# EAGLE schematic sc (EAGLE 7.3.0)
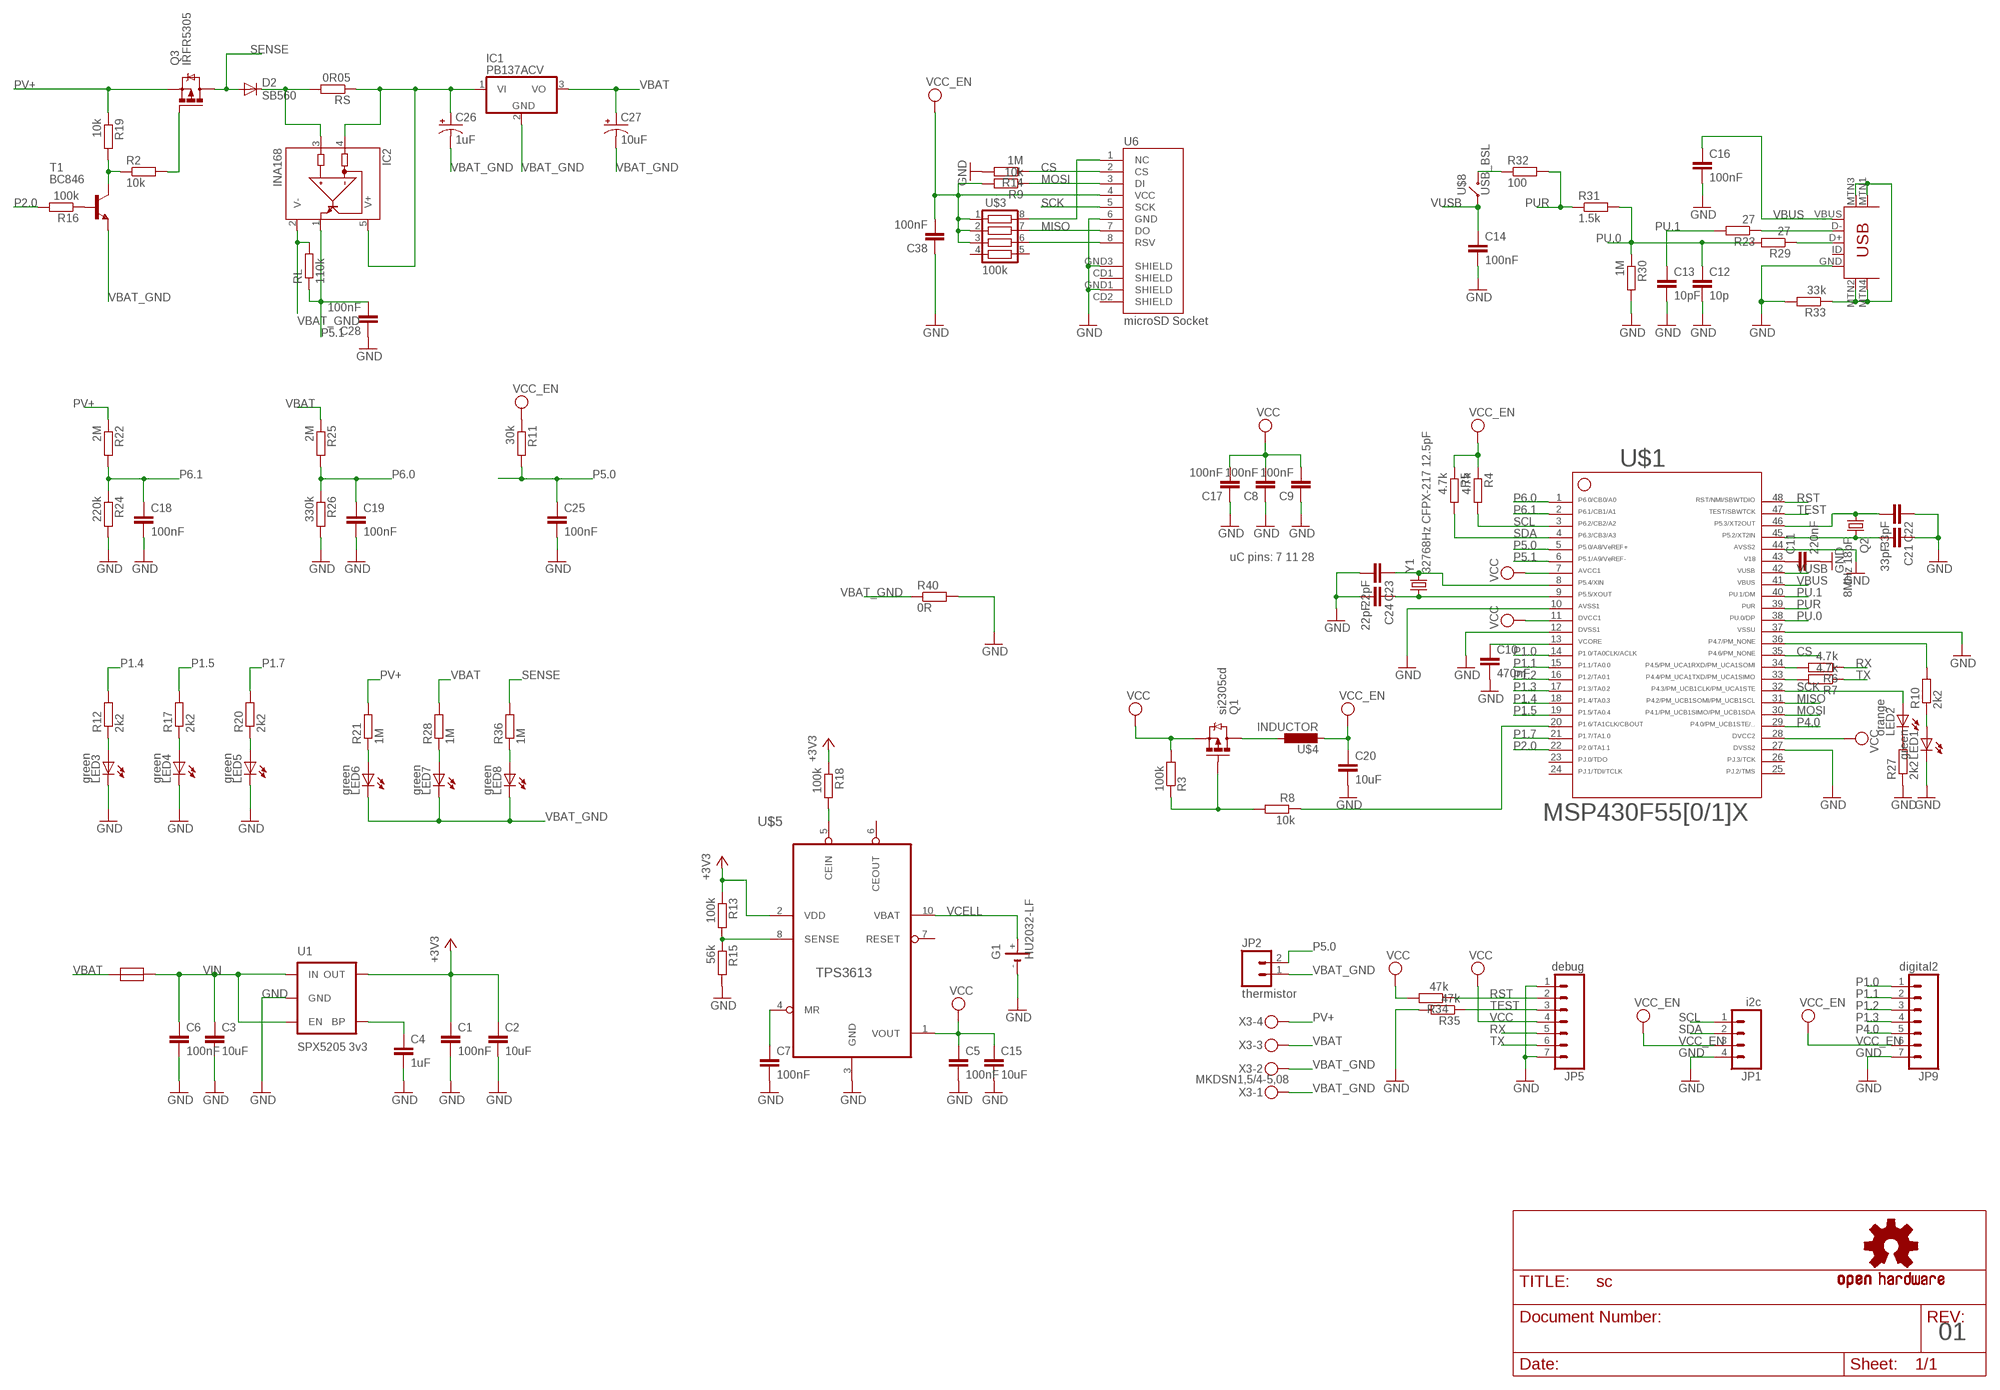
[diagram p0: schematic, sheet 1]

## Parts
C1  100nF  C-EUC0805  [C0805]
C2  10uF  C-EUC1206  [C1206]
C3  10uF  C-EUC1206  [C1206]
C4  1uF  C-EUC0805  [C0805]
C5  100nF  C-EUC0805  [C0805]
C6  100nF  C-EUC0805  [C0805]
C7  100nF  C-EUC0805  [C0805]
C8  100nF  C-EUC0805  [C0805]
C9  100nF  C-EUC0805  [C0805]
C10  470nF  C-EUC0805  [C0805]
C11  220nF  C-EUC0805  [C0805]
C12  10p  C-EUC0805  [C0805]
C13  10pF  C-EUC0805  [C0805]
C14  100nF  C-EUC0805  [C0805]
C15  10uF  C-EUC1206  [C1206]
C16  100nF  C-EUC0805  [C0805]
C17  100nF  C-EUC0805  [C0805]
C18  100nF  C-EUC0805  [C0805]
C19  100nF  C-EUC0805  [C0805]
C20  10uF  C-EUC1206  [C1206]
C21  33pF  C-EUC0805  [C0805]
C22  33pF  C-EUC0805  [C0805]
C23  22pF  C-EUC0805  [C0805]
C24  22pF  C-EUC0805  [C0805]
C25  100nF  C-EUC0805  [C0805]
C26  1uF  CAP_POLD  [PANASONIC_D]
C27  10uF  CAP_POLD  [PANASONIC_D]
C28  100nF  C-EUC0805  [C0805]
C38  100nF  C-EUC0805  [C0805]
D2  SB560  DIODE-C1702-05  [C1702-05]
G1  HU2032-LF  [HU2032-LF]
IC1  PB137ACV  7812TV  [TO220V]
IC2  INA168  [SOT23-5]
JP1  i2c  M04PTH  [1X04]
JP2  thermistor  M02PTH  [1X02]
JP5  debug  M07  [1X07]
JP9  digital2  M07  [1X07]
LED1  green  LEDCHIP-LED0805  [CHIP-LED0805]
LED2  orange  LEDCHIP-LED0805  [CHIP-LED0805]
LED3  green  LEDCHIP-LED0805  [CHIP-LED0805]
LED4  green  LEDCHIP-LED0805  [CHIP-LED0805]
LED5  green  LEDCHIP-LED0805  [CHIP-LED0805]
LED6  green  LEDCHIP-LED0805  [CHIP-LED0805]
LED7  green  LEDCHIP-LED0805  [CHIP-LED0805]
LED8  green  LEDCHIP-LED0805  [CHIP-LED0805]
Q1  si2305cd  MOSFET-PCHANNELSMD_POWER  [SOT23-3_POWER]
Q2  8MHz 18pF  CRYTAL  [CRYSTAL_5X3.2]
Q3  IRFR5305  [D-PAK_TO252AA]
R2  10k  R-EU_R0805W  [R0805W]
R3  100k  R-EU_R0805W  [R0805W]
R4  4.7k  R-EU_R0805W  [R0805W]
R5  4.7k  R-EU_R0805W  [R0805W]
R6  4.7k  R-EU_R0805W  [R0805W]
R7  4.7k  R-EU_R0805W  [R0805W]
R8  10k  R-EU_R0805W  [R0805W]
R9  10k  R-EU_R0805W  [R0805W]
R10  2k2  R-EU_R0805W  [R0805W]
R11  30k  R-EU_R0805W  [R0805W]
R12  2k2  R-EU_R0805W  [R0805W]
R13  100k  R-EU_R0805W  [R0805W]
R14  1M  R-EU_R0805W  [R0805W]
R15  56k  R-EU_R0805W  [R0805W]
R16  100k  R-EU_R0805W  [R0805W]
R17  2k2  R-EU_R0805W  [R0805W]
R18  100k  R-EU_R0805W  [R0805W]
R19  10k  R-EU_R0805W  [R0805W]
R20  2k2  R-EU_R0805W  [R0805W]
R21  1M  R-EU_R0805W  [R0805W]
R22  2M  R-EU_R0805W  [R0805W]
R23  27  R-EU_R0805W  [R0805W]
R24  220k  R-EU_R0805W  [R0805W]
R25  2M  R-EU_R0805W  [R0805W]
R26  330k  R-EU_R0805W  [R0805W]
R27  2k2  R-EU_R0805W  [R0805W]
R28  1M  R-EU_R0805W  [R0805W]
R29  27  R-EU_R0805W  [R0805W]
R30  1M  R-EU_R0805W  [R0805W]
R31  1.5k  R-EU_R0805W  [R0805W]
R32  100  R-EU_R0805W  [R0805W]
R33  33k  R-EU_R0805W  [R0805W]
R34  47k  R-EU_R0805W  [R0805W]
R35  47k  R-EU_R0805W  [R0805W]
R36  1M  R-EU_R0805W  [R0805W]
R40  0R  R-EU_R0805W  [R0805W]
RL  110k  R-EU_R0805W  [R0805W]
RS  0R05  R-EU_TO220_V  [TO220ACS]
T1  BC846  [SOT23]
U1  SPX5205 3v3  V_REG_LDOSMD  [SOT23-5]
U6  microSD Socket  USD-SOCKETNEW  [MICRO-SD-SOCKET-PP]
U$1  F55[0/1]X---PT48  [PT48]
U$2  RESETTABLE  [1210]
U$3  100k  RES_ARR  [YC164]
U$4  INDUCTOR  [L0805W]
U$5  TPS3613  [MSOP_10P]
U$6  USB-MINIB-5PIN  [USB-MINIB]
U$7  OSHW-LOGOM  [OSHW-LOGO-M]
U$8  USB_BSL  TACT_SW  [6X3.5_TACTILE_SW]
X3  MKDSN1,5/4-5,08  [MKDSN1,5/4-5,08]
Y1  32768Hz CFPX-217 12.5pF  CRYSTAL3.2X1.5  [CRYSTAL-SMD-3.2X1.5]

## Nets
+3V3: C1.1 C2.1 R13.1 R18.1 U1.5(OUT) U$5.2(VDD)
CS: R14.1 U6.2(CS) U$1.35
EN: R8.1 U$1.20
GND: C1.2 C2.2 C3.2 C4.2 C5.2 C6.2 C7.2 C8.1 C9.1 C10.2 C11.2 C12.2 C13.2 C14.2 C15.2 C16.2 C17.1 C18.2 C19.2 C20.2 C21.1 C22.1 C23.2 C24.2 C25.2 C28.1 C38.1 G1.- JP1.4 JP5.1 JP5.7 JP9.7 LED1.C LED3.C LED4.C LED5.C R14.2 R15.2 R24.2 R26.2 R27.1 R30.2 R33.2 R35.2 R40.2 U1.2(GND) U6.6(GND) U6.GND1(SHIELD) U6.GND3(SHIELD) U$1.10 U$1.12 U$1.27 U$1.37 U$1.44 U$5.3(GND) U$6.GND
LED: R10.2 U$1.36
MISO: U6.7(DO) U$1.31 U$3.7
MOSI: R9.1 U6.3(DI) U$1.30
N$1: LED1.A R10.1
N$2: C4.1 U1.4(BP)
N$3: R16.1 T1.1(B)
N$4: U6.1(NC) U$3.8
N$5: R2.1 R19.2 T1.3(C)
N$6: C10.1 U$1.13
N$7: C11.1 U$1.43
N$9: LED3.A R12.1
N$10: C26.+ IC1.1(VI) IC2.4(IN-) IC2.5(V+) RS.A
N$11: R6.2 U$1.34
N$12: LED6.A R21.1
N$13: R7.2 U$1.33
N$14: Q1.1(G) R3.1 R8.2
N$15: LED4.A R17.1
N$16: LED5.A R20.1
N$17: C22.2 Q2.P$1 U$1.46
N$18: LED7.A R28.1
N$19: R13.2 R15.1 U$5.8(SENSE)
N$20: C7.1 U$5.4(MR)
N$21: R18.2 U$5.5(CEIN)
N$22: R29.1 U$6.D+
N$23: C21.2 Q2.P$2 U$1.45
N$24: LED8.A R36.1
N$25: C24.1 U$1.9 Y1.P$1
N$26: C23.1 U$1.8 Y1.P$2
N$27: U6.8(RSV) U$3.6
N$28: Q3.1(G) R2.2
N$29: R23.1 U$6.D-
N$30: D2.C IC2.3(IN+) RS.C
N$34: R32.1 U$8.2
N$36: R33.1 U$6.MTN1(MTN2) U$6.MTN2(MTN3) U$6.MTN3(MTN1) U$6.MTN4
N$37: Q1.3(D) U$4.1
N$39: LED2.C R27.2
P1.0: JP9.1 U$1.14
P1.1: JP9.2 U$1.15
P1.2: JP9.3 U$1.16
P1.3: JP9.4 U$1.17
P1.4: R12.2 U$1.18
P1.5: R17.2 U$1.19
P1.7: R20.2 U$1.21
P2.0: R16.2 U$1.22
P4.0: JP9.5 U$1.29
P5.0: C25.1 JP2.2 R11.2 U$1.5
P5.1: C28.2 IC2.1(OUT) RL.1 U$1.6
P6.0: C19.1 R25.2 R26.1 U$1.1
P6.1: C18.1 R22.2 R24.1 U$1.2
PU.0: C12.1 R29.2 R30.1 R31.2 U$1.38
PU.1: C13.1 R23.2 U$1.40
PUR: R31.1 R32.2 U$1.39
PV+: Q3.3(S) R19.1 R21.2 R22.1 X3.4
RST: JP5.2 R34.1 U$1.48
RX: JP5.5 R6.1
SCK: LED2.A U6.5(SCK) U$1.32
SCL: JP1.1 R4.2 U$1.3
SDA: JP1.2 R5.2 U$1.4
SENSE: D2.A Q3.4(D) R36.2
TEST: JP5.3 R35.1 U$1.47
TX: JP5.6 R7.1
VBAT: C27.+ IC1.3(VO) R25.1 R28.2 U$2.P$1 X3.3
VBAT_GND: C26.- C27.- IC1.2(GND) IC2.2(V-) JP2.1 LED6.C LED7.C LED8.C R40.1 RL.2 T1.2(E) X3.1 X3.2
VBUS: C16.1 U$1.41 U$6.VBUS
VCC: C5.1 C8.2 C9.2 C15.1 C17.2 JP5.4 Q1.2(S) R3.2 R34.2 U$1.7 U$1.11 U$1.28 U$5.1(VOUT)
VCC_EN: C20.1 C38.2 JP1.3 JP9.6 R4.1 R5.1 R9.2 R11.1 U6.4(VCC) U$3.1 U$3.2 U$3.3 U$4.2
VCELL: G1.+ U$5.10(VBAT)
VIN: C3.1 C6.1 U1.1(IN) U1.3(EN) U$2.P$2
VUSB: C14.1 U$1.42 U$8.1
Unconnected: G1.+@1(+) U6.CD1(SHIELD) U6.CD2(SHIELD) U$1.23 U$1.24 U$1.25 U$1.26 U$3.4 U$3.5 U$5.6(CEOUT) U$5.7(RESET) U$6.ID

## Notes on the sheet
- uC pins: 7 11 28
- 01

## Library data of the parts
C1-C25 C28 C38 = rcl:C-EU: CAPACITOR, European symbol
C26 C27 = SparkFun-Capacitors:CAP_POL: Capacitor Polarized These are standard SMD and PTH capacitors. Normally 10uF, 47uF, and 100uF in electrolytic and tantalum varieties. Always verify the external diameter of the through hole cap, it varies with capacity, voltage, and manufacturer. The EIA devices should be standard.
D2 = diode:DIODE-: DIODE
G1 = Simplex-Battery:HU2032-LF: Renata HU2032 Li battery holder
IC1 = linear:78*: Positive VOLTAGE REGULATOR Source: http://cache.national.com/ds/LM/LM78L05.pdf http://www.fairchildsemi.com/ds/LM/LM7805.pdf
IC2 = burr-brown:INA168: High-Side Measurement Current Shunt Monitor; MF: TEXAS INSTRUMENTS; MPN: INA168NA/250; OC_FARNELL: 4375737; OC_NEWARK: 35C1744
JP1 = SparkFun-Connectors:M04: Header 4 Standard 4-pin 0.1" header. Use with straight break away headers (SKU : PRT-00116), right angle break away headers (PRT-00553), swiss pins (PRT-00743), machine pins (PRT-00117), and female headers (PRT-00115). Molex polarized connector foot print use with SKU : PRT-08231 with associated crimp pins and housings. 1MM SMD Version SKU: PRT-10208
JP2 = SparkFun-Connectors:M02: Header 2 Standard 2-pin 0.1" header. Use with straight break away headers (SKU : PRT-00116), right angle break away headers (PRT-00553), swiss pins (PRT-00743), machine pins (PRT-00117), and female headers (PRT-00115). Molex polarized connector foot print use with SKU : PRT-08233 with associated crimp pins and housings.
JP5 JP9 = SparkFun-Connectors:M07: Header 7 Standard 7-pin 0.1" header. Use with straight break away headers (SKU : PRT-00116), right angle break away headers (PRT-00553), swiss pins (PRT-00743), machine pins (PRT-00117), and female headers (PRT-00115). NOTES ON THE VARIANTS LOCK and LOCK_LONGPADS... This footprint was designed to help hold the alignment of a through-hole component (i.e. 7-pin header) while soldering it into place. You may notice that each hole has been shifted either up or down by 0.005 of an inch from it's more standard position (which is usually a perfectly straight line). This slight alteration caused the pins (the squares in the middle) to touch the edges of the holes. Because they are alternating, it causes a "brace" to hold the header in place. 0.005 has proven to be the perfect amount of "off-center" position when using our standard breakaway headers. Although looks a little odd when you look at the bare footprint, once you have a header in there, the alteration is very hard to notice. Also, if you push a header all the way into place, it is covered up entirely on the bottom side. This idea of altering the position of holes to aid alignment will be further integrated into the Sparkfun Library for other footprints. It can help hold any component with 3 or more connection pins.
LED1-LED8 = led:LED: LED OSRAM: - CHIPLED LG R971, LG N971, LY N971, LG Q971, LY Q971, LO R971, LY R971 LH N974, LH R974 LS Q976, LO Q976, LY Q976 LO Q996 - Hyper CHIPLED LW Q18S LB Q993, LB Q99A, LB R99A - SideLED LS A670, LO A670, LY A670, LG A670, LP A670 LB A673, LV A673, LT A673, LW A673 LH A674 LY A675 LS A676, LA A676, LO A676, LY A676, LW A676 LS A679, LY A679, LG A679 - Hyper Micro SIDELED® LS Y876, LA Y876, LO Y876, LY Y876 LT Y87S - SmartLED LW L88C, LW L88S LB L89C, LB L89S, LG L890 LS L89K, LO L89K, LY L89K LS L896, LA L896, LO L896, LY L896 - TOPLED LS T670, LO T670, LY T670, LG T670, LP T670 LSG T670, LSP T670, LSY T670, LOP T670, LYG T670 LG T671, LOG T671, LSG T671 LB T673, LV T673, LT T673, LW T673 LH T674 LS T676, LA T676, LO T676, LY T676, LB T676, LH T676, LSB T676, LW T676 LB T67C, LV T67C, LT T67C, LS T67K, LO T67K, LY T67K, LW E67C LS E67B, LA E67B, LO E67B, LY E67B, LB E67C, LV E67C, LT E67C LW T67C LS T679, LY T679, LG T679 LS T770, LO T770, LY T770, LG T770, LP T770 LB T773, LV T773, LT T773, LW T773 LH T774 LS E675, LA E675, LY E675, LS T675 LS T776, LA T776, LO T776, LY T776, LB T776 LHGB T686 LT T68C, LB T68C - Hyper Mini TOPLED® LB M676 - Mini TOPLED Santana® LG M470 LS M47K, LO M47K, LY M47K Source: http://www.osram.convergy.de LUXEON: - LUMILED® LXK2-PW12-R00, LXK2-PW12-S00, LXK2-PW14-U00, LXK2-PW14-V00 LXK2-PM12-R00, LXK2-PM12-S00, LXK2-PM14-U00 LXK2-PE12-Q00, LXK2-PE12-R00, LXK2-PE12-S00, LXK2-PE14-T00, LXK2-PE14-U00 LXK2-PB12-K00, LXK2-PB12-L00, LXK2-PB12-M00, LXK2-PB14-N00, LXK2-PB14-P00, LXK2-PB14-Q00 LXK2-PR12-L00, LXK2-PR12-M00, LXK2-PR14-Q00, LXK2-PR14-R00 LXK2-PD12-Q00, LXK2-PD12-R00, LXK2-PD12-S00 LXK2-PH12-R00, LXK2-PH12-S00 LXK2-PL12-P00, LXK2-PL12-Q00, LXK2-PL12-R00 Source: www.luxeon.com KINGBRIGHT: KA-3528ASYC Source: www.kingbright.com
Q1 = Simplex-DiscreteSemi:MOSFET-PCHANNEL: Generic PMOSFET
Q2 = Omat_komponentit:CRYTAL: CRYSTAL
Q3 = transistor-power:IRF?5305: HEXFET Power MOSFET Source: http://www.irf.com/product-info/datasheets/data/irfr5305pbf.pdf
R2-R36 R40 RL = rcl:R-EU_: RESISTOR, European symbol
RS = Simplex-rlc:R-EU_: RESISTOR, European symbol
T1 = transistor:BC846: NPN TRANSISTOR
U1 = SparkFun:V_REG_LDO: Voltage Regulator LDO Standard 150mA LDO voltage regulator in SOT-23 layout. Micrel part MIC5205. BP (by-pass) pin is used to lower output noise with 470pF cap.
U6 = SparkFun:USD-SOCKET: microSD Socket Push-push type uSD socket. Schematic element and footprint production proven. Spark Fun Electronics SKU : PRT-00127. tDoc lines correctly indicate media card edge positions when inserting (unlocked, locked, depressed).
U$1 = TI_MSP430_v16:F55[0/1]X---PT48: ***F55[0/1/2]X*** PT48 Rev. 1.0 06/2010 "http://www.ti.com/lit/gpn/msp430f5509" Only for FF5504, F5508,F5509,F5510
U$2 = Simplex-Fuses:RESETTABLE
U$3 = Simplex-rlc:RES_ARR: resistor chip array yageo YC164 series (8pin/4R)
U$4 = Simplex-rlc:INDUCTOR: smd inductors
U$5 = Simplex-ICs:TPS3613: Texas Instruments TPS3613 Adjustable battery-backup supervisor for RAM retension
U$6 = SparkFun-Connectors:USB-MINIB: Mini-USB "B" connector with 5th pin broken out. Created new symbol breaking out 5th "ID" pin in mini/micro USB connector spec. See: http://en.wikipedia.org/wiki/Mini_usb#Cables. Uses same footprint as 4-pin symbol. Also added pins to connect to mounting / shield pads if required (probably not generally needed as signals aren't shielded once they leave the connector).
U$7 = SparkFun:OSHW-LOGO: Open Source Hardware Logo This logo indicates the piece of hardware it is found on incorporates a OSHW license and/or adheres to the definition of open source hardware found here: http://freedomdefined.org/OSHW
U$8 = Simplex-Switches:TACT_SW: SPST tactile switches
X3 = con-phoenix-508:MKDSN1,5/4-5,08: MKDSN 1,5/ 4-5,08 Printklemme Nennstrom: 13,5 A Nennspannung: 250 V Rastermaß: 5,08 mm Polzahl: 4 Anschlussart: Schraubanschluss Montage: Löten Anschlussrichtung Leiter/Platine: 0 ° Artikelnummer: 1729144 Source: http://eshop.phoenixcontact.com .. 1729144.pdf; MPN: SMKDSN1,5/4-5,08; OC_FARNELL: 1792905; OC_NEWARK: 70R0300
Y1 = Simplex-FreqCtrl:CRYSTAL: smd crystals

## Net classes
1 vcc: width 0.203 mm